# EAGLE design speculator_minor_breakout_54mm_v1 (EAGLE 9.6.2)
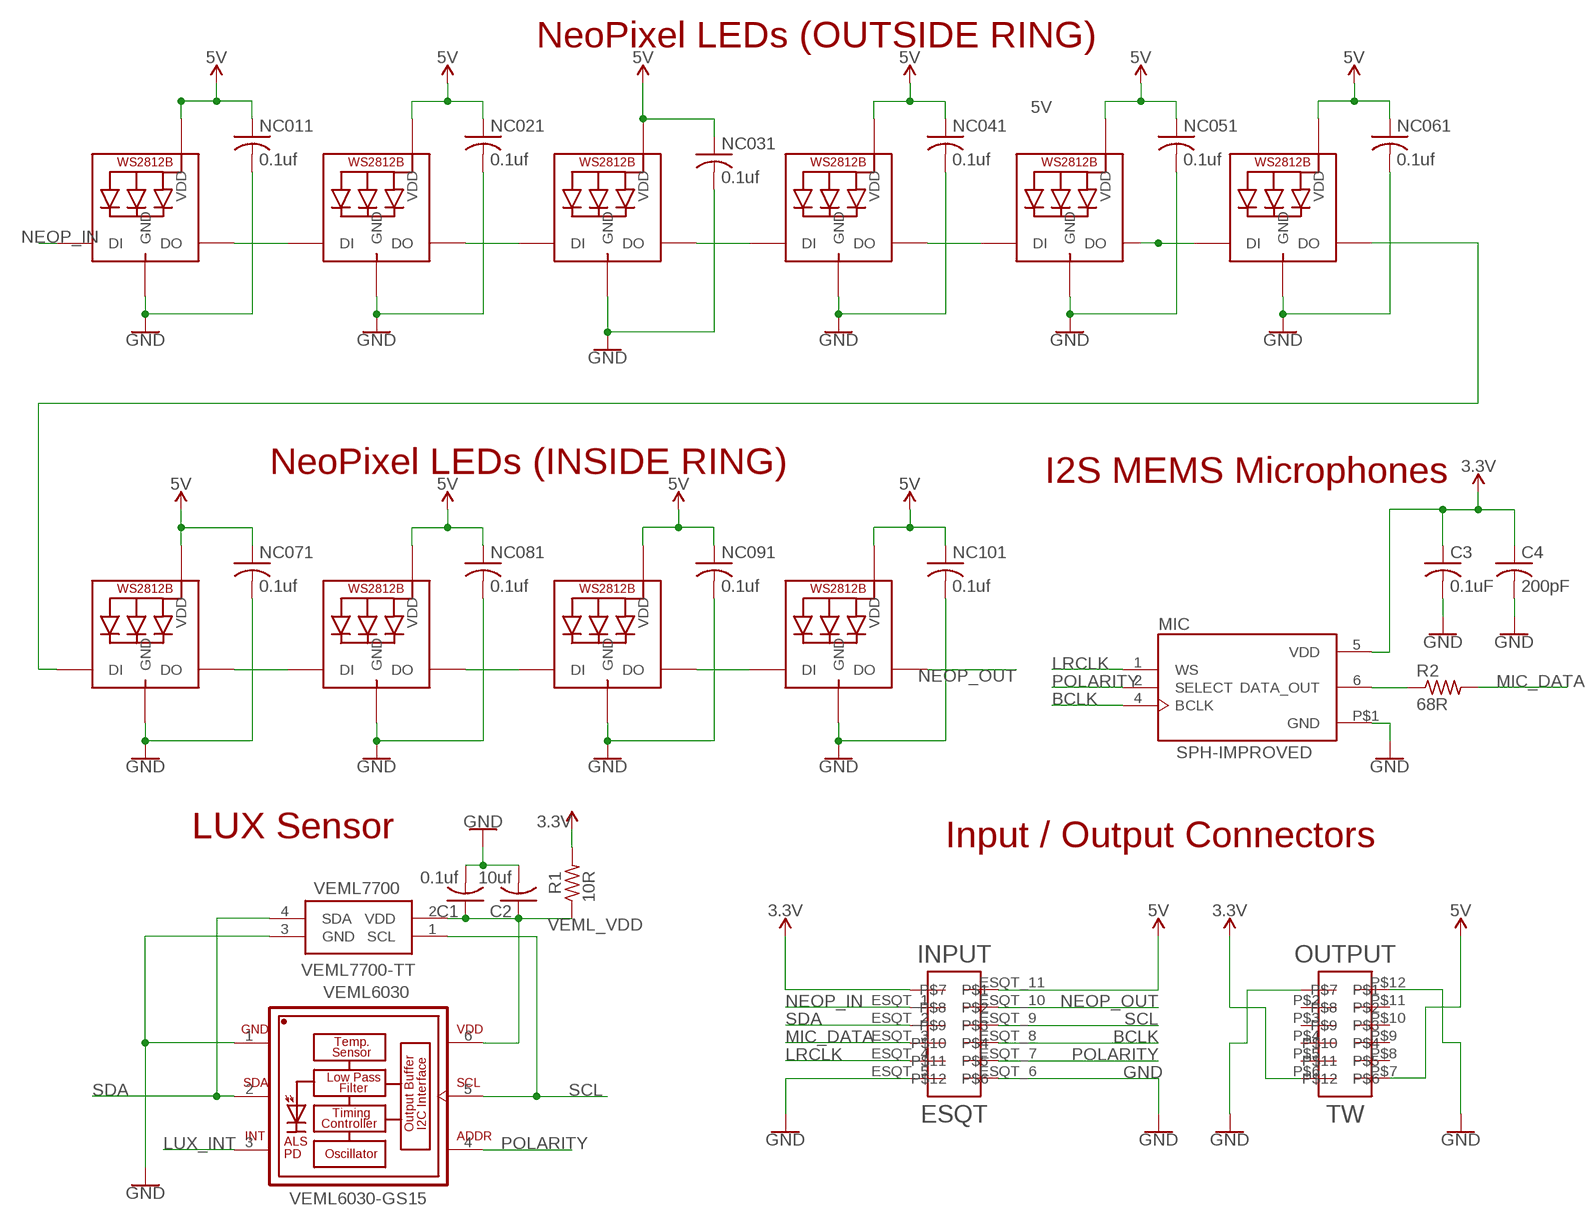
[diagram p0: schematic, sheet 1]

## Parts
C1  0.1uf  C-USC0805  [C0805]
C2  10uf  C-USC0805  [C0805]
C3  0.1uF  C-USC0805  [C0805]
C4  200pF  C-USC0805  [C0805]
INPUT  ESQT  SAMTEC_ESQT_2X6_THROUGH_HOLE  [SAMTEC_ESQT_2X6_THROUGH_HOLE]
MIC  SPH-IMPROVED  [MIC_SPH0645LM4H-B_LARGER_RING]
NC011  0.1uf  C-USC0805K  [C0805K]
NC021  0.1uf  C-USC0805K  [C0805K]
NC031  0.1uf  C-USC0805K  [C0805K]
NC041  0.1uf  C-USC0805K  [C0805K]
NC051  0.1uf  C-USC0805K  [C0805K]
NC061  0.1uf  C-USC0805K  [C0805K]
NC071  0.1uf  C-USC0805K  [C0805K]
NC081  0.1uf  C-USC0805K  [C0805K]
NC091  0.1uf  C-USC0805K  [C0805K]
NC101  0.1uf  C-USC0805K  [C0805K]
NEO1  WS2812B5050  [WS2812B]
NEO2  WS2812B5050  [WS2812B]
NEO3  WS2812B5050  [WS2812B]
NEO4  WS2812B5050  [WS2812B]
NEO5  WS2812B5050  [WS2812B]
NEO6  WS2812B5050  [WS2812B]
NEO07  WS2812B5050  [WS2812B]
NEO08  WS2812B5050  [WS2812B]
NEO9  WS2812B5050  [WS2812B]
NEO10  WS2812B5050  [WS2812B]
OUTPUT  TW  SAMTEC_TW_2X6_WITH_STABLE  [SAMTEC_TW_2X6]
R1  10R  R-US_R0805  [R0805]
R2  68R  R-US_M0805  [M0805]
VEML6030  VEML6030-GS15  [VISHAY_VEML6030_2X2X0.87]
VEML7700  VEML7700-TT  [VEML7700]

## Nets
3.3V: C3.1 C4.1 INPUT.ESQT_0 MIC.5(VDD) OUTPUT.P$6 R1.2
5V: INPUT.ESQT_11 NC011.1 NC021.1 NC031.1 NC041.1 NC051.1 NC061.1 NC071.1 NC081.1 NC091.1 NC101.1 NEO1.1-VDD(VDD) NEO2.1-VDD(VDD) NEO3.1-VDD(VDD) NEO4.1-VDD(VDD) NEO5.1-VDD(VDD) NEO6.1-VDD(VDD) NEO07.1-VDD(VDD) NEO08.1-VDD(VDD) NEO9.1-VDD(VDD) NEO10.1-VDD(VDD) OUTPUT.P$7
1232135: NEO08.2-DOUT(DO) NEO9.4-DIN(DI)
BCLK: INPUT.ESQT_8 MIC.4(BCLK)
GND: C1.2 C2.2 C3.2 C4.2 INPUT.ESQT_5 INPUT.ESQT_6 MIC.P$1(GND) NC011.2 NC021.2 NC031.2 NC041.2 NC051.2 NC061.2 NC071.2 NC081.2 NC091.2 NC101.2 NEO1.3-GND(GND) NEO2.3-GND(GND) NEO3.3-GND(GND) NEO4.3-GND(GND) NEO5.3-GND(GND) NEO6.3-GND(GND) NEO07.3-GND(GND) NEO08.3-GND(GND) NEO9.3-GND(GND) NEO10.3-GND(GND) OUTPUT.P$1 OUTPUT.P$12 VEML6030.1(GND) VEML7700.3(GND)
LRCLK: INPUT.ESQT_4 MIC.1(WS)
LUX_INT: VEML6030.3(INT)
MIC_DATA: INPUT.ESQT_3 R2.2
N$1: NEO3.2-DOUT(DO) NEO4.4-DIN(DI)
N$2: NEO4.2-DOUT(DO) NEO5.4-DIN(DI)
N$3: NEO9.2-DOUT(DO) NEO10.4-DIN(DI)
N$4: NEO07.2-DOUT(DO) NEO08.4-DIN(DI)
N$5: NEO6.2-DOUT(DO) NEO07.4-DIN(DI)
N$10: NEO5.2-DOUT(DO) NEO6.4-DIN(DI)
N$13: NEO1.2-DOUT(DO) NEO2.4-DIN(DI)
N$17: MIC.6(DATA_OUT) R2.1
N$21: NEO2.2-DOUT(DO) NEO3.4-DIN(DI)
NEOP_IN: INPUT.ESQT_1 NEO1.4-DIN(DI)
NEOP_OUT: INPUT.ESQT_10 NEO10.2-DOUT(DO)
POLARITY: INPUT.ESQT_7 MIC.2(SELECT) VEML6030.4(ADDR)
SCL: INPUT.ESQT_9 VEML6030.5(SCL) VEML7700.1(SCL)
SDA: INPUT.ESQT_2 VEML6030.2(SDA) VEML7700.4(SDA)
VEML_VDD: C1.1 C2.1 R1.1 VEML6030.6(VDD) VEML7700.2(VDD)
Unconnected: OUTPUT.P$2 OUTPUT.P$3 OUTPUT.P$4 OUTPUT.P$5 OUTPUT.P$8 OUTPUT.P$9 OUTPUT.P$10 OUTPUT.P$11

## Notes on the sheet
- NeoPixel LEDs (OUTSIDE RING)
- NeoPixel LEDs (INSIDE RING) | I2S MEMS Microphones
- LUX Sensor
- Input / Output Connectors
- 10R

## Library data of the parts
C1-C4 NC011 NC021 NC031 NC041 NC051 NC061 NC071 NC081 NC091 NC101 = rcl:C-US: CAPACITOR, American symbol; SPICEPREFIX: C
INPUT = nathans-custom-parts:SAMTEC_ESQT_2X6_THROUGH_HOLE
MIC = SPH0645LM4H-B:SPH-IMPROVED
NEO1-NEO6 NEO07 NEO08 NEO9 NEO10 = adafruit-with-additions:WS2812B
OUTPUT = nathans-custom-parts:SAMTEC_TW_2X6_WITH_STABLE
R1 = audio amplifier example:R-US_: RESISTOR, American symbol
R2 = adafruit:R-US_: RESISTOR, American symbol
VEML6030 = VEML6030-GS15:VEML6030-GS15: VEML6030 High Accuracy Ambient Light Sensor with I2C Interface: VEML6030 is a high accuracy ambient light digital 16-bit resolution sensor in a miniature transparent 2 mm x 2 mm package. It includes a high sensitive photodiode, a low noise amplifier, a 16-bit A/D converter and supports an easy to use I2C bus communication interface and additional interrupt feature. The ambient light result is as digital value available. Device Model created 15.06.2016 by Johannes Kolb - Vishay Semiconductor GmbH; AVAILABILITY: Unavailable; DESCRIPTION: Optical Sensor Ambient 550nm I²C 6-SMD, No Lead; MF: Vishay Semiconductor; MP: VEML6030-GS15; PACKAGE: SMD-6 Vishay; PRICE: None
VEML7700 = VEML7700-TT:VEML7700-TT: 16Bit Ambient Light Sensor I2C 6.8x2.3mm Source: Datasheet <https://www.arrow.com/en/products/veml7700-tt/vishay>; DESCRIPTION: 16Bit Ambient Light Sensor I2C 6.8x2.3mm; HEIGHT: mm; MANUFACTURER_NAME: Vishay; MANUFACTURER_PART_NUMBER: VEML7700-TT; MOUSER_PART_NUMBER: 78-VEML7700-TT; MOUSER_PRICE-STOCK: https://www.mouser.com/Search/Refine.aspx?Keyword=78-VEML7700-TT; RS_PART_NUMBER: 1226791P; RS_PRICE-STOCK: http://uk.rs-online.com/web/p/products/1226791P

## Net classes
0 default: width 0.152 mm, drill 0.254 mm, clearance 0.152 mm

## Board
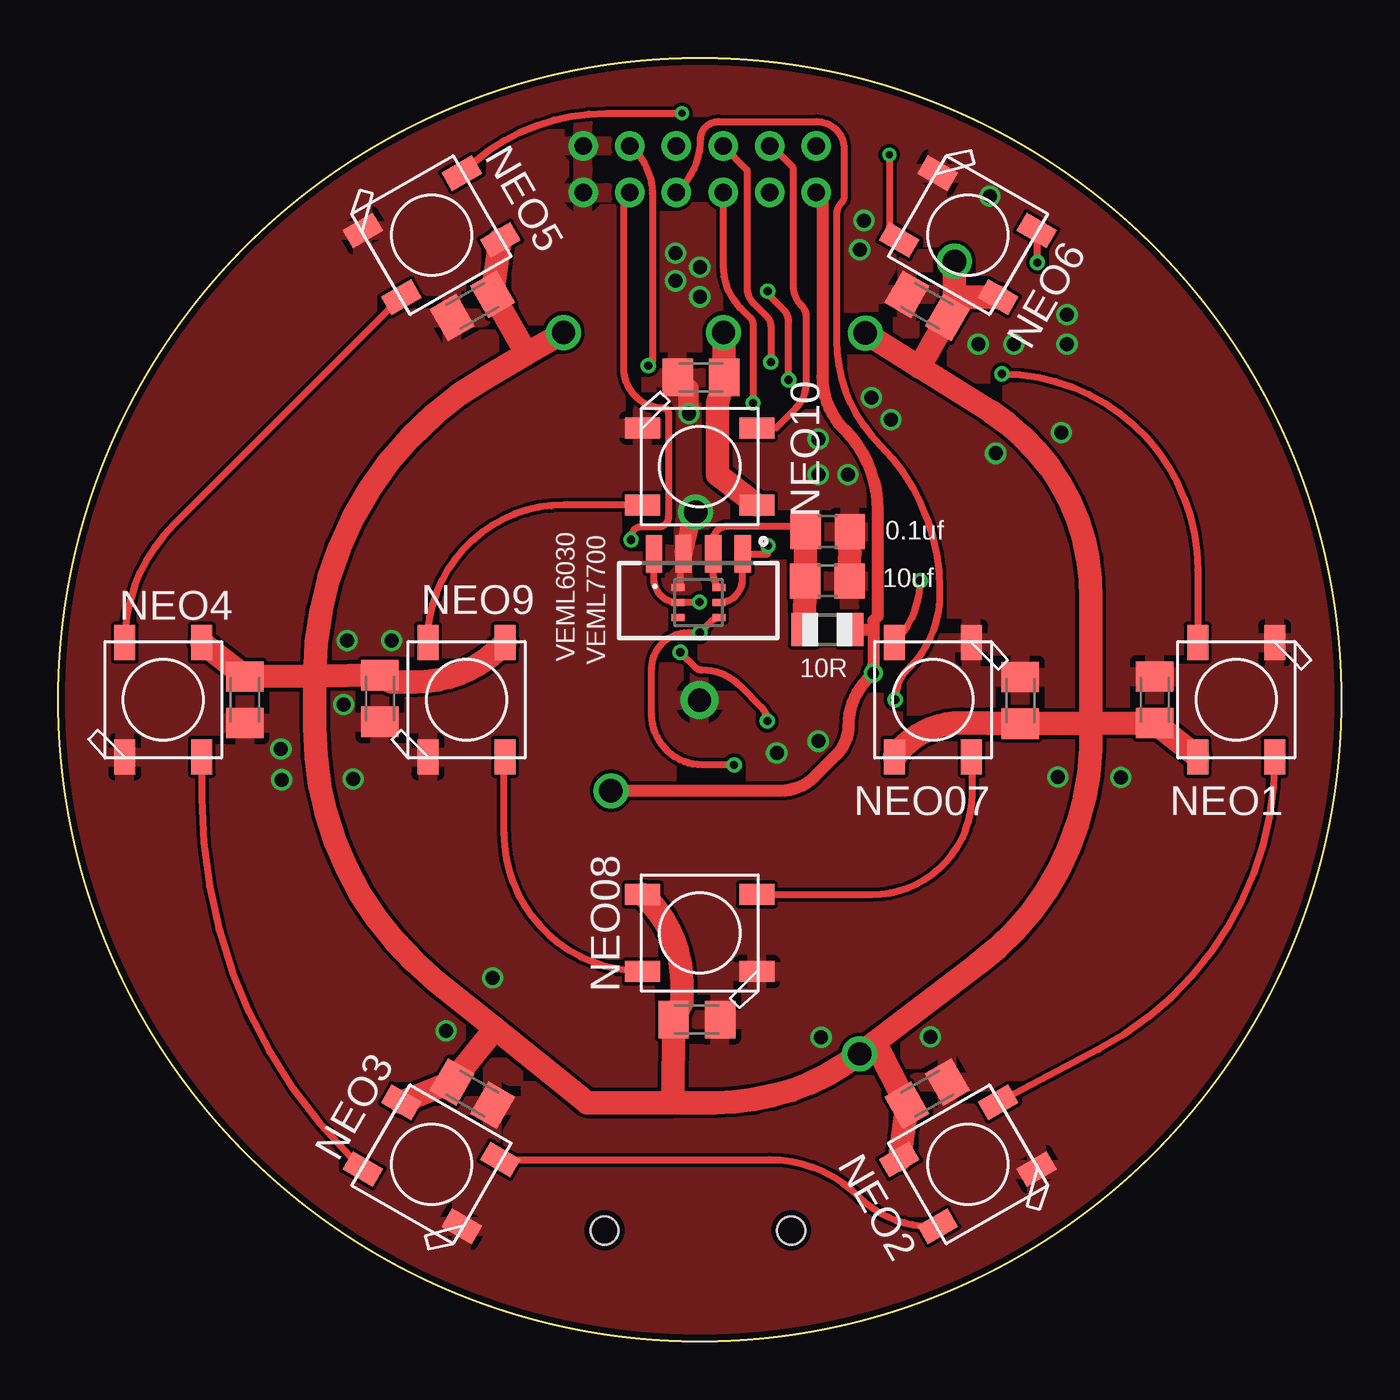
[diagram p1: board, top side]
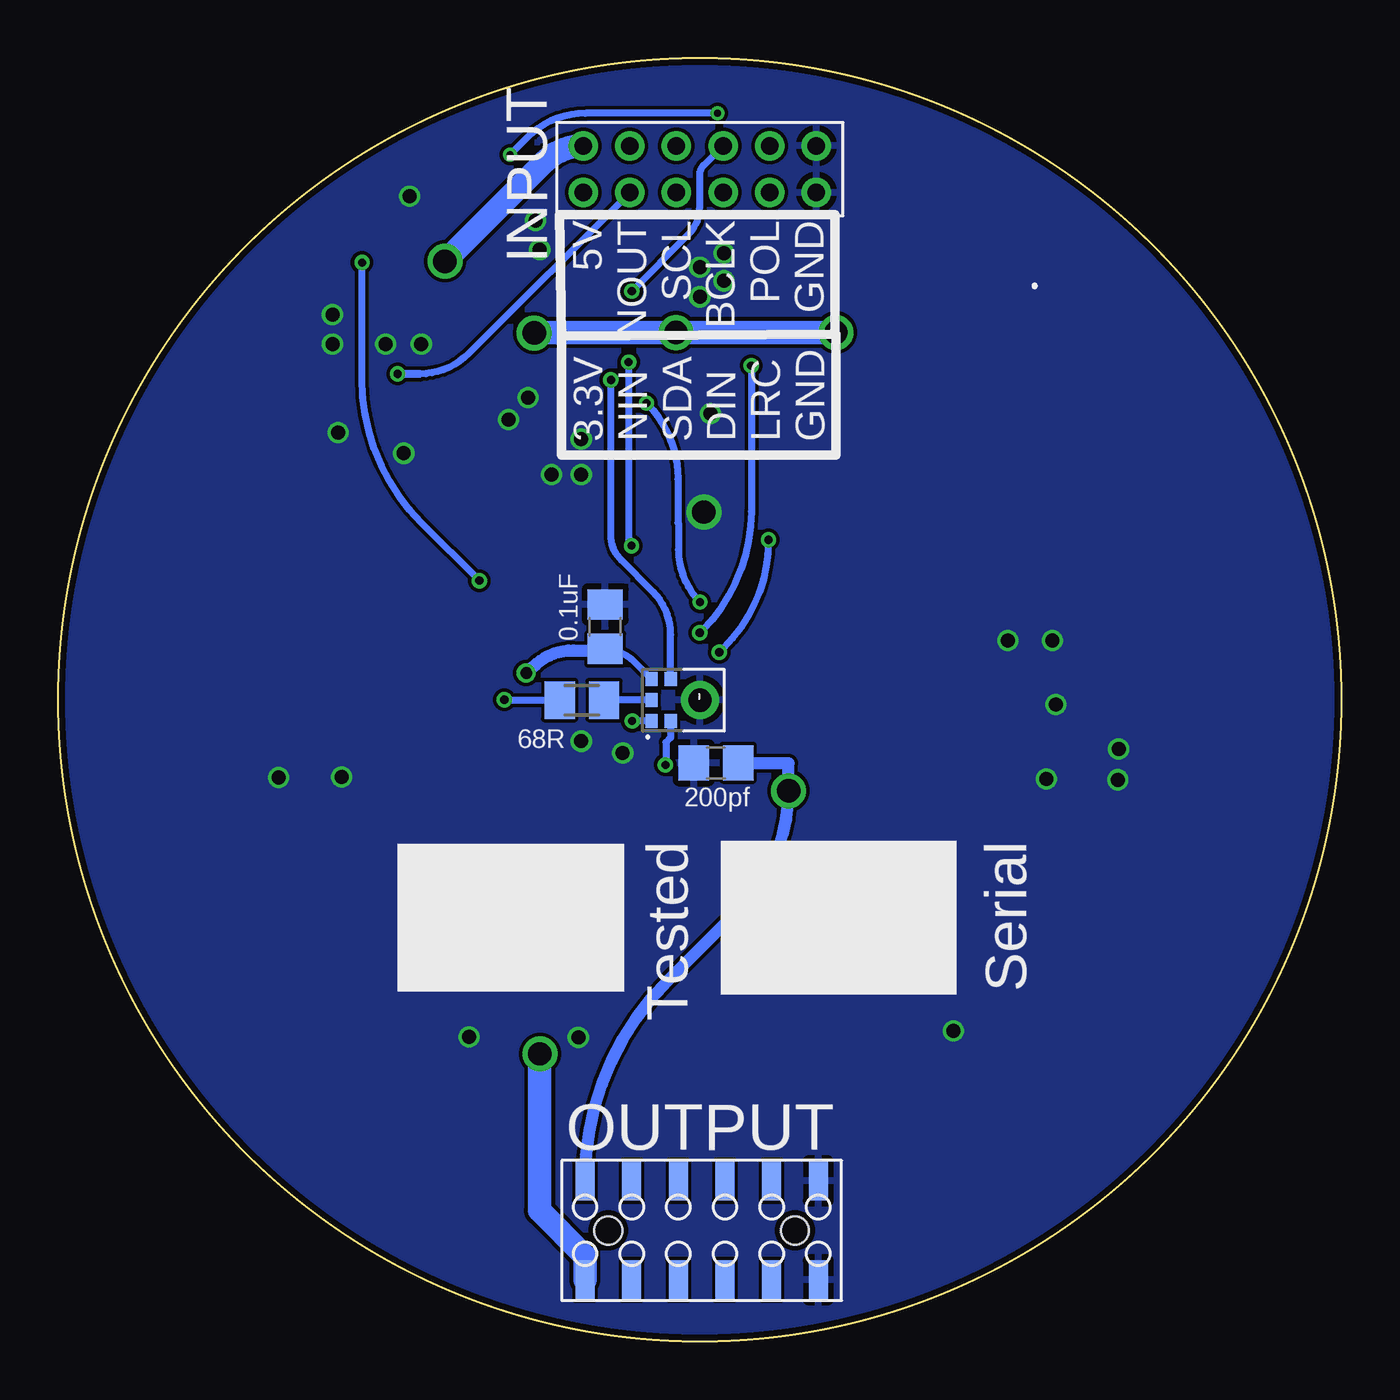
[diagram p2: board, bottom side, seen from below]

Size 55 x 55 mm. Coordinates in mm from the lower left corner, seen from the top.
Outline: circle at 27.5,27.5 radius 27.5
Copper layers (1*16): Top 0.035mm / dielectric 1.5mm / Bottom 0.035mm
Design rules "SeeedStudio_2layer_DRU_no_angle_20140221": minimum track width 6mil, minimum drill 12mil, track to track 6mil, track to pad 6mil, pad to pad 6mil, via to via 6mil, smd to smd 0mil, copper to edge 10mil, drill to drill 10mil, minimum pad ring 10mil, minimum via ring 6mil, stop-mask expansion 2mil, vias tented up to drill 100mil, thermal gap 10mil

### Footprints (pad centres in the part's own frame; a part is rotated, then mirrored left to right if it is on the bottom)
C0805 = smd 1.3 x 1.5: 1 -0.95,0; 2 0.95,0
SAMTEC_ESQT_2X6_THROUGH_HOLE = drill 0.75: ESQT_0 -5,-1; ESQT_1 -3,-1; ESQT_2 -1,-1; ESQT_3 1,-1; ESQT_4 3,-1; ESQT_5 5,-1; ESQT_6 5,1; ESQT_7 3,1; ESQT_8 1,1; ESQT_9 -1,1; ESQT_10 -3,1; ESQT_11 -5,1
MIC_SPH0645LM4H-B_LARGER_RING = smd 0.6 x 0.522: 1 -0.9,2.074; 2 -0.9,1.252; 4 0.9,1.252; 5 0.9,2.074; 6 0,2.074 | drill 1 pad 1.626: P$1 0,0
C0805K = smd 1.3 x 1.6: 1 -1,0; 2 1,0
WS2812B = smd 1.5 x 0.9: 1-VDD 2.45,-1.65; 2-DOUT 2.45,1.65; 3-GND -2.45,1.65; 4-DIN -2.45,-1.65
SAMTEC_TW_2X6 = smd 0.813 x 1.676: P$1 5.08,2.125; P$2 3.08,2.125; P$3 1.08,2.125; P$4 -0.92,2.125; P$5 -2.92,2.125; P$6 -4.92,2.125; P$7 -4.92,-2.125; P$8 -2.92,-2.125; P$9 -0.92,-2.125; P$10 1.08,-2.125; P$11 3.08,-2.125; P$12 5.08,-2.125 | hole 1.2: 4.08,0; -3.92,0
R0805 = smd 1.1 x 1.4: 1 -1,0; 2 1,0
M0805 = smd 1.3 x 1.6: 1 -0.95,0; 2 0.95,0
VISHAY_VEML6030_2X2X0.87 = smd 0.55 x 0.3: 1 -0.875,0.65; 2 -0.875,0; 3 -0.875,-0.65; 4 0.875,-0.65; 5 0.875,0; 6 0.875,0.65
VEML7700 = smd 0.7 x 1.6: 1 1.495,-0.4; 2 2.765,-0.4; 3 4.035,-0.4; 4 5.305,-0.4

### Placement (x,y rotation side)
C1  32.99,34.71 0 top
C2  32.98,32.6 0 top
C3  31.56,30.63 90 bottom
C4  26.8,24.79 180 bottom
INPUT  27.5,50.25 0 bottom
MIC  27.49,27.48 90 bottom
NC011  47,27.5 90 top
NC021  13.79,27.55 270 top
NC031  17.75,10.61 330 top
NC041  8,27.5 270 top
NC051  17.75,44.39 210 top
NC061  37.25,44.39 150 top
NC071  27.37,13.79 0 top
NC081  27.55,41.32 180 top
NC091  41.24,27.47 90 top
NC101  37.25,10.61 30 top
NEO1  50.5,27.5 270 top
NEO2  39,7.58 210 top
NEO3  16,7.58 150 top
NEO4  4.5,27.5 90 top
NEO5  16,47.42 30 top
NEO6  39,47.42 330 top
NEO07  37.5,27.5 270 top
NEO08  27.5,17.5 180 top
NEO9  17.5,27.5 90 top
NEO10  27.5,37.5 0 top
OUTPUT  27.5,4.75 0 bottom
R1  32.98,30.51 0 top
R2  32.55,27.48 180 bottom
VEML6030  27.45,31.67 0 top
VEML7700  30.84,33.36 180 top

### Tracks (layer width: path | path; a pad name or v marks a point on that pad's centre or on a via)
3.3V  (via drill 0.5, 1)
  Top 0.508: INPUT.ESQT_0 32.75,48.99 32.75,41.35 arc45 33.69,39.09 arc-45 35.12,35.63 35.12,31.07 34.94,30.89 34.94,30.56 | v23.69,23.6 30.98,23.6 arc45 32.41,24.19 33.34,25.12 arc45 33.87,26.41 arc-45 34.7,28.4 v34.94,28.64 34.94,29.01 34.94,30.56 | 34.94,30.56 34.89,30.51 R1.2
  Bottom 0.203: C3.1 31.5,29.62
  Bottom 0.305: MIC.5 30.33,29.14 arc-45 31.48,29.62
  Bottom 0.508: v34.94,28.64 34.69,28.9 34.66,28.9 arc45 32.92,29.62 31.5,29.62 31.48,29.62 | C4.1 23.69,24.78 v23.69,23.6 v23.69,23.59 arc45 25.78,18.55 28.86,15.48 arc-45 OUTPUT.P$6
5V  (via drill 1)
  Top 1.016: 44.26,26.49 44.26,31.82 arc59 39.98,39.84 v34.6,43.22 36.92,41.76 NC061.1 38.42,44.19 38.42,44.77 | 44.26,26.49 44.26,25.38 arc-51 39.43,16.18 35.02,12.82 | 35.02,12.82 v34.35,12.31 arc-37 28.16,10.23 26.36,10.23 | 26.36,10.23 22.67,10.23 22.37,10.48 18.72,13.41 | 26.36,10.23 NC071.1 26.74,14.55 26.74,15.3 arc47 NEO08.1-VDD | 20.08,42.33 v21.66,43.25 | 20.08,42.33 18.39,41.36 arc60 10.99,28.52 | 10.99,28.52 10.99,26.32 arc51 16.2,15.43 18.72,13.41 | 18.72,13.41 NC031.1 NEO3.1-VDD | NEO4.1-VDD NC041.1 10.99,28.52 | 10.99,28.52 NC021.1 14.29,28.26 15.3,28.26 arc47 NEO9.1-VDD | 20.08,42.33 NC051.1 NEO5.1-VDD | 44.26,26.49 NC091.1 39.93,26.48 39.89,26.51 38.73,26.51 arc54 NEO07.1-VDD | 44.26,26.49 NC011.1 NEO1.1-VDD | NEO10.1-VDD 28.26,37.15 28.26,40.23 NC081.1 v28.52,43.25 | v28.52,43.25 | v38.42,46.3 38.42,44.77 | NEO6.1-VDD 38.43,44.77 38.42,44.77 | 35.02,12.82 NC101.1 NEO2.1-VDD
  Bottom 1.016: v21.66,43.25 v28.52,43.25 34.1,43.25 34.14,43.22 v34.6,43.22 | INPUT.ESQT_11 | INPUT.ESQT_11 arc-45 34.16,50.56 v38.42,46.3 | OUTPUT.P$7 32.42,3.64 34.38,5.6 34.38,12.29
  Bottom 1.27: v34.35,12.31 34.38,12.29
1232135
  Top 0.305: NEO08.2-DOUT arc-90 19.12,21.78 19.12,25.02 NEO9.4-DIN
BCLK  (via drill 0.35)
  Top 0.305: v31.31,41.22 31.31,43.71 arc45 31.1,44.22 30.36,44.96 v30.41,45.02
  Bottom 0.305: v31.31,41.22 31.31,34.57 arc-45 30.86,33.48 29.5,32.12 arc45 28.75,30.29 MIC.4 | v30.41,45.02 28,47.44 arc-45 27.5,48.64 27.5,50 arc45 27.33,50.42 INPUT.ESQT_8
GND  (via drill 0.6, 1)
  Top 0.305: VEML6030.1 26.65,32.39 26.65,33.6 VEML7700.3
  Top 0.762: VEML7700.3 27.25,35.63 v27.33,35.55
  Top 0.889: v27.04,39.77 27.04,40.02 27.02,40.04 27.02,40.85 NC081.2
  Top 1.016: C2.2 C1.2
  other vias: 26.46,45.46 27.5,44.77 27.5,46.04 26.46,46.65 34.36,46.8 34.54,48.05 39.44,42.74 40.96,42.74 43.25,42.74 43.25,44.01 39.95,49.09 43,38.95 34.87,40.45 40.19,38.07 9.54,25.39 12.23,27.3 9.57,24.07 12.64,24.1 32.58,38.68 32.58,37.15 33.85,37.15 35.7,39.51 30.8,25.21 32.58,25.72 45.55,24.17 42.85,24.19 37.38,13.05 32.71,13.02 16.62,13.3 18.62,15.57 12.38,30.04 14.29,30.04
  pour Top: 27.04,55.06 29.95,55.06 arc-90 56.34,28.67 arc-90 27.61,-0.07 26.06,-0.07 arc-90 -1.01,27.01 arc-90
  pour Bottom: 46.57,48 arc45 29.48,55.07 27.16,55.07 arc90 -0.17,27.74 arc90 27.77,-0.2 28.47,-0.2 arc45 46.57,7.3 arc90
LRCLK  (via drill 0.35)
  Top 0.305: INPUT.ESQT_4 24.25,48.99 24.25,41.71 arc90 25.95,40 arc-90 26.16,39.8 26.16,35.32 arc-90 25.75,34.91 25,34.91 arc90 24.55,34.47 v24.55,34.36 | v30.4,26.59 arc45 30.15,27.18 29.24,28.09 arc45 27.6,28.77 arc-45 27.3,28.89 v26.66,29.53
  Bottom 0.305: MIC.1 30.29,26.58 30.29,26.59 v30.4,26.59 | v24.55,34.36 arc45 26.47,29.72 v26.66,29.53
MIC_DATA  (via drill 0.35)
  Top 0.305: INPUT.ESQT_3 26.65,49.4 arc45 27.54,51.53 arc-90 28.29,52.28 32.52,52.28 arc-90 33.69,51.11 33.69,49.09 arc-45 33.57,48.8 arc45 33.37,48.3 33.37,42.91 arc45 35.23,38.42 arc-45 37.78,32.25 37.78,31.98 arc-45 36.51,28.9 36.43,28.83 arc45 v35.88,27.5
  Bottom 0.305: v35.88,27.5 35.87,27.48 R2.2
N$1
  Top 0.305: NEO4.4-DIN 6.15,23.27 arc45 12.5,7.93 NEO3.2-DOUT
N$2
  Top 0.305: NEO5.4-DIN 4.94,35.01 arc45 NEO4.2-DOUT
N$3
  Top 0.305: NEO10.4-DIN 21.68,35.85 arc90 15.82,29.98 NEO9.2-DOUT
N$4
  Top 0.305: NEO08.4-DIN 34.87,19.15 arc90 39.18,23.46 39.18,25.02 NEO07.2-DOUT
N$5  (via drill 0.35)
  Top 0.305: NEO07.4-DIN arc45 v36.95,32.6 v36.95,32.61 | v41.98,46.25 41.98,47.59 NEO6.2-DOUT
  Bottom 0.305: v36.95,32.61 39.41,35.07 arc45 41.98,41.26 v41.98,46.25
N$10  (via drill 0.3)
  Top 0.305: NEO5.2-DOUT arc-45 23.51,52.65 v26.74,52.65 | v35.63,50.87 35.63,47.57 35.98,47.22 NEO6.4-DIN
  Bottom 0.305: v26.74,52.65 32.4,52.65 arc-45 34.88,51.62 v35.63,50.87
N$13
  Top 0.305: NEO1.2-DOUT | NEO1.2-DOUT arc-62 44.59,12.51 NEO2.4-DIN
N$17
  Bottom 0.203: 31.57,27.48 R2.1
  Bottom 0.305: MIC.6 31.57,27.48
N$21
  Top 0.305: NEO3.4-DIN 30.49,7.79 arc-45 34.32,6.2 arc45 37.39,4.93 NEO2.2-DOUT
NEOP_IN  (via drill 0.35)
  Top 0.305: v40.45,41.47 arc-90 48.85,33.07 NEO1.4-DIN
  Bottom 0.305: INPUT.ESQT_1 37.4,42.34 arc45 39.51,41.47
  Bottom 0.35: 39.51,41.47 v40.45,41.47
NEOP_OUT
  Top 0.305: NEO10.2-DOUT 30.77,39.15 31.62,40.01 arc45 32.07,41.09 32.07,43.92 arc45 31.88,44.38 arc-45 31.51,45.27 31.51,50.31 30.58,51.25 INPUT.ESQT_10
POLARITY  (via drill 0.35)
  Top 0.305: INPUT.ESQT_7 24.72,51.03 arc-45 25.47,49.21 25.47,42 v25.29,41.83 | VEML6030.4 arc45 28.02,30.89 v27.5,30.37 26.98,30.37 arc90 25.44,28.84 25.44,26.87 arc90 27.61,24.71 v28.97,24.71
  Bottom 0.305: MIC.2 28.75,25.87 28.95,25.67 28.95,24.73 v28.97,24.71 | v25.29,41.83 25.29,35.58 arc45 27.41,30.46 v27.5,30.37
SCL  (via drill 0.35)
  Top 0.305: INPUT.ESQT_9 29.53,50.21 29.53,45.15 arc45 29.8,44.5 30.38,43.92 arc-45 30.55,43.52 v30.55,41.98 | v30.42,34.11 30.42,33.76 VEML7700.1 29.33,33.74 29.33,32.67 arc-90 VEML6030.5
  Bottom 0.305: v30.55,41.98 30.55,34.23 v30.42,34.11
SDA  (via drill 0.35)
  Top 0.305: INPUT.ESQT_2 28.5,46.11 arc45 29.25,44.29 29.68,43.87 arc-45 29.79,43.6 v29.79,40.22 | VEML7700.4 25.52,33.74 25.52,32.72 arc90 VEML6030.2 27.47,31.67 v27.49,31.69
  Bottom 0.305: v29.79,40.22 arc45 28.43,36.95 28.43,35.09 28.41,35.07 28.41,33.92 arc-45 v27.49,31.69
VEML_VDD
  Top 0.305: VEML6030.6 arc-45 28.08,32.91 VEML7700.2 28.08,34.32 arc-90 28.7,34.94 31.8,34.94 C1.1
  Top 1.016: R1.1 31.98,30.63 C2.1 C1.1

### Text on the board
bPlace: 5V / NOUT / SCL / BCLK / POL / GND | 3.3V / NIN / SDA / DIN / LRC / GND | 200pf
tNames: /Users/nathan/Desktop/moth_01.bmp
bNames: Serial | Tested
bValues: 2020 | Designed by / Nathan Villicana-Shaw | Moth Breakout v1.0